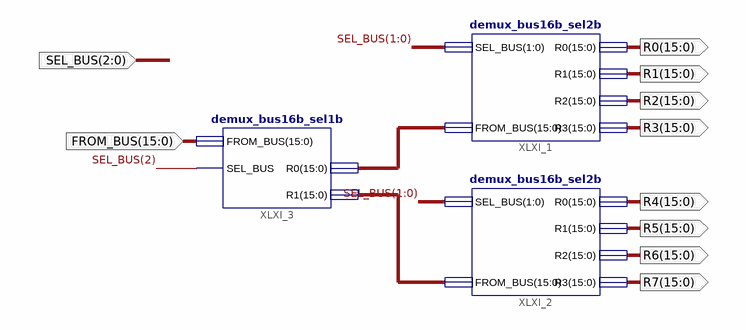
[diagram p0: schematic sheet 1]
// Xilinx ISE schematic demux_bus16b_sel3b.sch (artix7) as structural Verilog: 3 symbols, 10 ports
module demux_bus16b_sel3b (
  input  [15:0] FROM_BUS,
  input  [2:0] SEL_BUS,
  output [15:0] R0,
  output [15:0] R1,
  output [15:0] R2,
  output [15:0] R3,
  output [15:0] R4,
  output [15:0] R5,
  output [15:0] R6,
  output [15:0] R7
);

  wire [15:0] XLXN_1, XLXN_2;

  demux_bus16b_sel2b XLXI_1 (.SEL_BUS(SEL_BUS[1:0]), .FROM_BUS(XLXN_1), .R0(R0), .R1(R1), .R2(R2), .R3(R3));
  demux_bus16b_sel2b XLXI_2 (.SEL_BUS(SEL_BUS[1:0]), .FROM_BUS(XLXN_2), .R0(R4), .R1(R5), .R2(R6), .R3(R7));
  demux_bus16b_sel1b XLXI_3 (.SEL_BUS(SEL_BUS[2]), .FROM_BUS(FROM_BUS), .R0(XLXN_1), .R1(XLXN_2));
endmodule
